# Altium schematic sheet High Pass Filter.SchDoc
size A
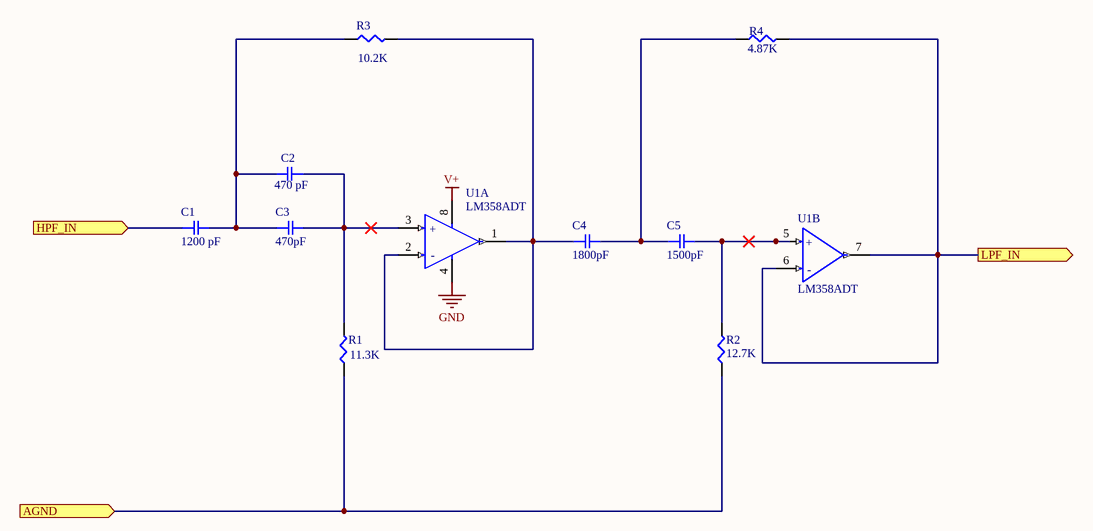
[diagram p0: High Pass Filter.SchDoc]

## Parts
C1  1200 pF  [SMD-0805C]
C2  470 pF  [SMD-0805C]
C3  470pF  [SMD-0805C]
C4  1800pF  [SMD-0805C]
C5  1500pF  [SMD-0805C]
R1  11.3K  [SMD-0805-RES]
R2  12.7K  [SMD-0805-RES]
R3  10.2K  [SMD-0805-RES]
R4  4.87K  [SMD-0805-RES]
U1  LM358ADT  [FP-SO8-IPC_C]  (parts A,B of 2)

## Ports
AGND (in), HPF_IN (in), LPF_IN (out)

## Nets
GND: U1.4(VCC-)
V+: U1.8(VCC+)
AGND: R1.1 R2.1 ; port AGND
HPF_IN: C1.1 ; port HPF_IN
LPF_IN: R4.2 U1.6(In2-) U1.7(Out2) ; port LPF_IN
NetC1_2: C1.2 C2.2 C3.1 R3.1
NetC2_1: C2.1 C3.2 R1.2 U1.3(In1+)
NetC4_1: C4.1 R3.2 U1.1(Out1) U1.2(In1-)
NetC4_2: C4.2 C5.1 R4.1
NetC5_2: C5.2 R2.2 U1.5(In2+)

## Notes on the sheet
- (in symbol CMP-12131-000002-1, part A) +; -
- (in symbol CMP-12131-000002-1, part B) +; -

## Library data of the parts
C1 = GRM216R71E122KA01D: Manufacturer: KEMET; Manufacturer Part Number: C0805C122J2GAC7800; Value: 1200pF; Descriptions: 1200 pF ±5% 200V Ceramic Capacitor C0G, NP0 0805 (2012 Metric); Datasheet Link: https://api.kemet.com/component-edge/download/datasheet/C0805C122J2GAC7800.pdf; Operating Temperature: -55°C ~ 125°C; Package / Case: 0805 (2012 Metric)
C2 = GCM2165C1H471JA16D: Manufacturer: KEMET; Manufacturer Part Number: C0805C471J1GAC7800; Value: 470pF; Descriptions: 470 pF ±5% 100V Ceramic Capacitor C0G, NP0 0805 (2012 Metric); Datasheet Link: https://api.kemet.com/component-edge/download/datasheet/C0805C471J1GACTU.pdf; Operating Temperature: -55°C ~ 125°C; Package / Case: 0805 (2012 Metric)
C3 = GCM2165C1H471JA16D: Manufacturer: KEMET; Manufacturer Part Number: C0805C471J1GAC7800; Descriptions: 470 pF ±5% 100V Ceramic Capacitor C0G, NP0 0805 (2012 Metric); Datasheet Link: https://api.kemet.com/component-edge/download/datasheet/C0805C471J1GACTU.pdf; Value: 470pF; Operating Temperature: -55°C ~ 125°C; Package / Case: 0805 (2012 Metric)
C4 = GRM216R71E182KA01D: Manufacturer: KEMET; Manufacturer Part Number: C0805C182K5RAC7800; Descriptions: 1800 pF ±10% 50V Ceramic Capacitor X7R 0805 (2012 Metric); Datasheet Link: https://api.kemet.com/component-edge/download/datasheet/C0805C182K5RACTU.pdf; Value: 1800pF; Operating Temperature: -55°C ~ 125°C; Package / Case: 0805 (2012 Metric)
C5 = GCJ216R71H152KA01D: Manufacturer: KEMET; Manufacturer Part Number: C0805C152JAGAC7800; Descriptions: 1500 pF ±5% 250V Ceramic Capacitor C0G, NP0 0805 (2012 Metric); Datasheet Link: https://api.kemet.com/component-edge/download/datasheet/C0805C152JAGAC7800.pdf; Value: 1500pF; Operating Temperature: -55°C ~ 125°C; Package / Case: 0805 (2012 Metric)
R1 = ERJ-6ENF1132V: Manufacturer: Stackpole Electronics Inc; Manufacturer Part Number: RNCF0805DTE11K3; Descriptions: 11.3 kOhms ±0.5% 0.125W, 1/8W Chip Resistor 0805 (2012 Metric) Automotive AEC-Q200 Thin Film; Datasheet Link: https://www.seielect.com/catalog/sei-rncf.pdf; Value: 11.3k; Operating Temperature: -55°C ~ 155°C; Package / Case: 0805 (2012 Metric)
R2 = ERJ-6ENF1272V: Manufacturer: Stackpole Electronics Inc; Manufacturer Part Number: RNCF0805DTE12K7; Descriptions: 12.7 kOhms ±0.5% 0.125W, 1/8W Chip Resistor 0805 (2012 Metric) Automotive AEC-Q200 Thin Film; Datasheet Link: https://www.seielect.com/catalog/sei-rncf.pdf; Value: 12.7k; Operating Temperature: -55°C ~ 155°C; Package / Case: 0805 (2012 Metric)
R3 = ERJ-6ENF1022V: Manufacturer: Stackpole Electronics Inc; Manufacturer Part Number: RNCF0805DTE10K2; Descriptions: 10.2 kOhms ±0.5% 0.125W, 1/8W Chip Resistor 0805 (2012 Metric) Automotive AEC-Q200 Thin Film; Datasheet Link: https://www.seielect.com/catalog/sei-rncf.pdf; Value: 10.2k; Operating Temperature: -55°C ~ 155°C; Package / Case: 0805 (2012 Metric)
R4 = ERJ-6ENF4871V: Manufacturer: Stackpole Electronics Inc; Manufacturer Part Number: RMCF0805FT4K87; Descriptions: 4.87 kOhms ±1% 0.125W, 1/8W Chip Resistor 0805 (2012 Metric) Automotive AEC-Q200 Thick Film; Datasheet Link: https://www.seielect.com/catalog/sei-rmcf_rmcp.pdf; Value: 4.87k; Operating Temperature: -55°C ~ 155°C; Package / Case: 0805 (2012 Metric)
U1 = CMP-12131-000002-1: Manufacturer Part Number: LM358WDT; Manufacturer: STMicroelectronics; Descriptions: General Purpose Amplifier 2 Circuit - 8-SOIC; RoHS: TRUE; Value: N/A; Operating Temperature: 0°C ~ 70°C; Datasheet Link: https://www.st.com/content/ccc/resource/technical/document/datasheet/82/55/37/12/85/cc/4c/29/CD00003160.pdf/files/CD00003160.pdf/jcr:content/translations/en.CD00003160.pdf; Package / Case: 8-SOIC